# Altium schematic sheet RK3588_BOOTLOADER_MAYBE_SDIO.SchDoc
size 594 x 420 mm; SheetNumber: 7; SheetTotal: 23
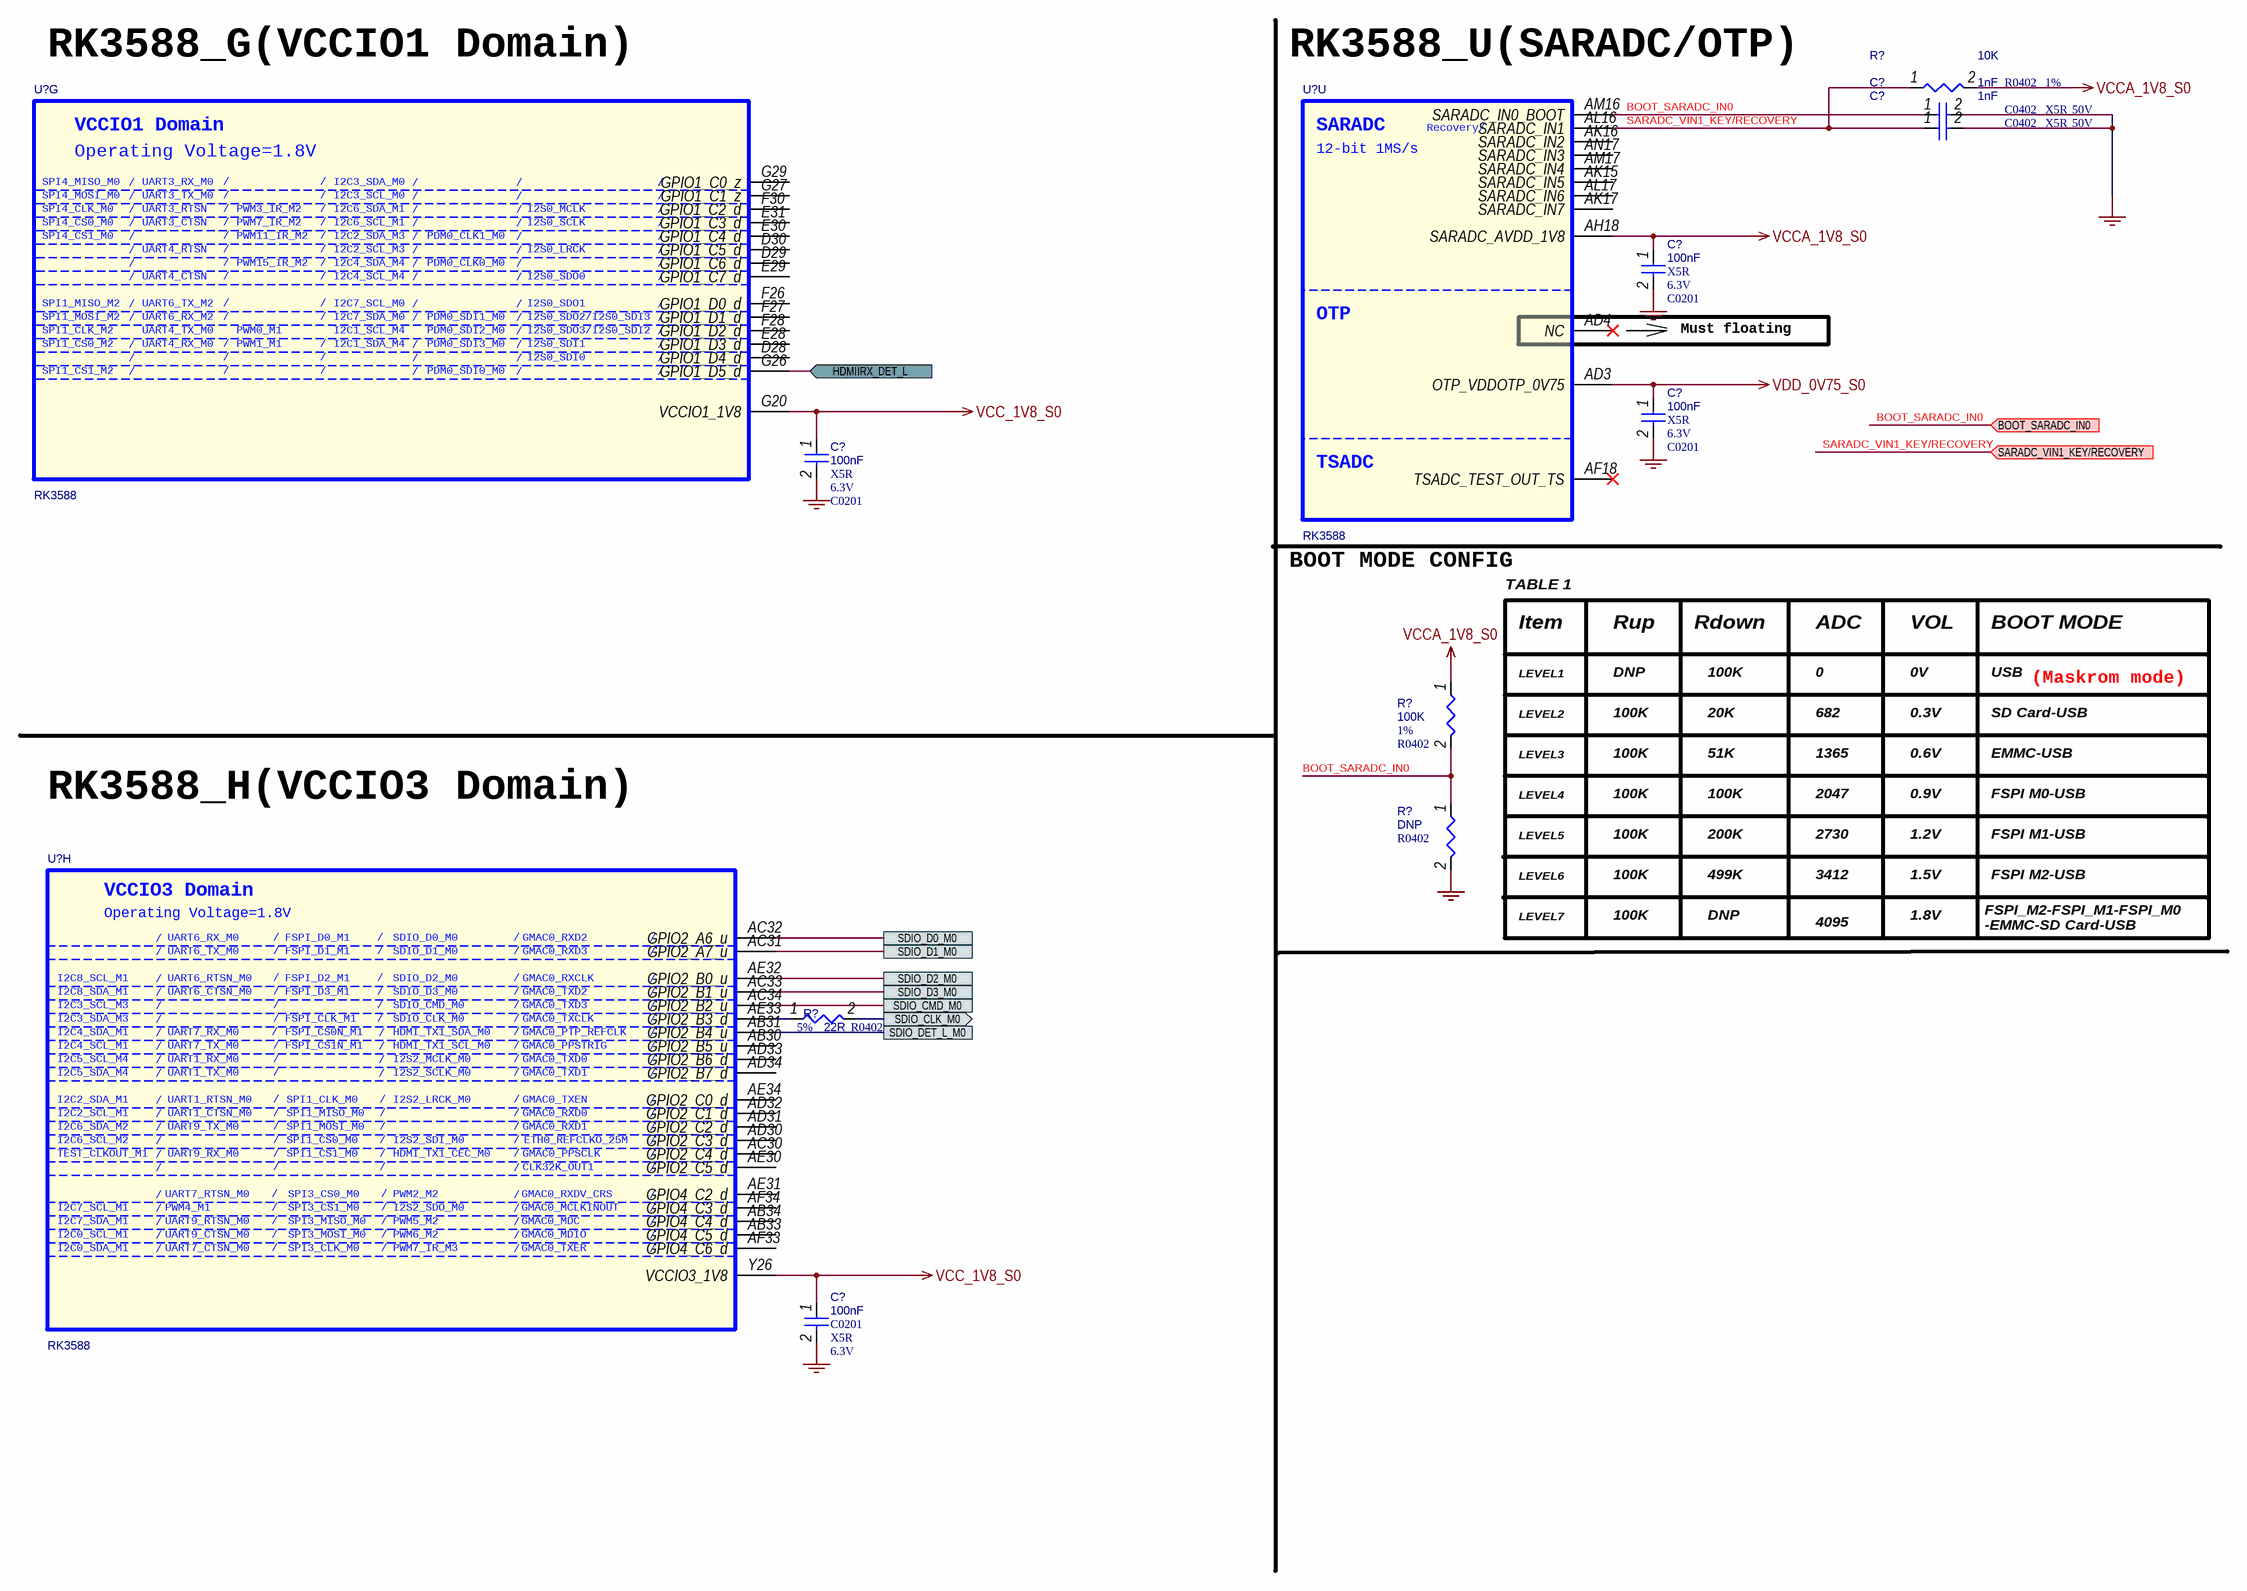
[diagram p0: RK3588_BOOTLOADER_MAYBE_SDIO.SchDoc]

## Parts
(Parts that share a designator on the sheet are numbered #1, #2 ... from top to bottom, then left to right.)
C?#1  1nF  Dielectric: X5R  Voltage: 50V  [C0402]
C?#2  1nF  Dielectric: X5R  Voltage: 50V  [C0402]
C?#3  100nF  Dielectric: X5R  Voltage: 6.3V  [C0201]
C?#4  100nF  Dielectric: X5R  Voltage: 6.3V  [C0201]
C?#5  100nF  Dielectric: X5R  Voltage: 6.3V  [C0201]
C?#6  100nF  Dielectric: X5R  Voltage: 6.3V  [C0201]
R?#1  10K  Tolerance: 1%  [R0402]
R?#2  100K  Tolerance: 1%  [R0402]
R?#3  DNP  [R0402]
R?#4  22R  Tolerance: 5%  [R0402]
U?#1  RK3588  [BGA1088_23R00X23R00X2R00]  (part G of 26)
U?#2  RK3588  [BGA1088_23R00X23R00X2R00]  (part U of 26)
U?#3  RK3588  [BGA1088_23R00X23R00X2R00]  (part H of 26)

## Ports
BOOT_SARADC_IN0 (in, see BUTTON[1C]), HDMIIRX_DET_L (in, see HDMI2_0_RX[4C]), SARADC_VIN1_KEY/RECOVERY (in, see BUTTON[1A]), SDIO_CLK_M0 (out, see SD_CARD_SDIO[2B]), SDIO_CMD_M0 (see SD_CARD_SDIO[2B]), SDIO_D0_M0 (see SD_CARD_SDIO[2B]), SDIO_D1_M0 (see SD_CARD_SDIO[2B]), SDIO_D2_M0 (see SD_CARD_SDIO[2B]), SDIO_D3_M0 (see SD_CARD_SDIO[2B]), SDIO_DET_L_M0 (see SD_CARD_SDIO[2B])

## Nets
GND: C?#1.2 C?#2.2 C?#3.2 C?#4.2 C?#5.2 C?#6.2 R?#3.2
VCC_1V8_S0: C?#5.1 C?#6.1 U?#1.G20(VCCIO1_1V8) U?#3.Y26(VCCIO3_1V8)
VCCA_1V8_S0: C?#3.1 R?#1.2 R?#2.1 U?#2.AH18(SARADC_AVDD_1V8)
VDD_0V75_S0: C?#4.1 U?#2.AD3(OTP_VDDOTP_0V75)
BOOT_SARADC_IN0: C?#1.1 R?#2.2 R?#3.1 U?#2.AM16(SARADC_IN0_BOOT) ; port BOOT_SARADC_IN0
HDMIIRX_DET_L: U?#1.G26(GPIO1_D5_d) ; port HDMIIRX_DET_L
SARADC_VIN1_KEY/RECOVERY: C?#2.1 R?#1.1 U?#2.AL16(SARADC_IN1) ; port SARADC_VIN1_KEY/RECOVERY
SDIO_CLK_M0: R?#4.2 ; port SDIO_CLK_M0
SDIO_CMD_M0: U?#3.AC34(GPIO2_B2_u) ; port SDIO_CMD_M0
SDIO_D0_M0: U?#3.AC32(GPIO2_A6_u) ; port SDIO_D0_M0
SDIO_D1_M0: U?#3.AC31(GPIO2_A7_u) ; port SDIO_D1_M0
SDIO_D2_M0: U?#3.AE32(GPIO2_B0_u) ; port SDIO_D2_M0
SDIO_D3_M0: U?#3.AC33(GPIO2_B1_u) ; port SDIO_D3_M0
SDIO_DET_L_M0: U?#3.AB31(GPIO2_B4_u) ; port SDIO_DET_L_M0
NetR?#4_1: R?#4.1 U?#3.AE33(GPIO2_B3_d)

Not connected (* = marked no-connect by the designer): U?#1 D28(GPIO1_D4_d) D29(GPIO1_C6_d) D30(GPIO1_C5_d) E28(GPIO1_D3_d) E29(GPIO1_C7_d) E30(GPIO1_C4_d) E31(GPIO1_C3_d) F26(GPIO1_D0_d) F27(GPIO1_D1_d) F28(GPIO1_D2_d) F30(GPIO1_C2_d) G27(GPIO1_C1_z) G29(GPIO1_C0_z); U?#2 AD4(NC)* AF18(TSADC_TEST_OUT_TS)* AK15(SARADC_IN5) AK16(SARADC_IN2) AK17(SARADC_IN7) AL17(SARADC_IN6) AM17(SARADC_IN4) AN17(SARADC_IN3); U?#3 AB30(GPIO2_B5_u) AB33(GPIO4_C5_d) AB34(GPIO4_C4_d) AC30(GPIO2_C4_d) AD30(GPIO2_C3_d) AD31(GPIO2_C2_d) AD32(GPIO2_C1_d) AD33(GPIO2_B6_d) AD34(GPIO2_B7_d) AE30(GPIO2_C5_d) AE31(GPIO4_C2_d) AE34(GPIO2_C0_d) AF33(GPIO4_C6_d) AF34(GPIO4_C3_d)

## Notes on the sheet
- RK3588_G(VCCIO1 Domain)
- (near U?#2) RK3588_U(SARADC/OTP)
- (near C?#3) Must floating
- BOOT MODE CONFIG
- TABLE 1
- LEVEL1
- Item
- Rup
- DNP
- Rdown
- 100K
- ADC
- 0
- VOL
- 0V
- BOOT MODE
- USB
- LEVEL2
- 20K
- 682
- 0.3V
- SD Card-USB
- (Maskrom mode)
- RK3588_H(VCCIO3 Domain)
- LEVEL3
- LEVEL4
- 51K
- 1365
- 2047
- 0.9V
- 0.6V
- EMMC-USB
- FSPI M0-USB
- LEVEL5
- 200K
- 2730
- 1.2V
- FSPI M1-USB
- LEVEL6
- LEVEL7
- 499K
- 3412
- 4095
- 1.8V
- 1.5V
- FSPI_M2-FSPI_M1-FSPI_M0
  -EMMC-SD Card-USB
- FSPI M2-USB
- 420x594
- Формат А2
- (in symbol SOC_RK3588, part G) VCCIO1 Domain; Operating Voltage=1.8V; SPI4_MISO_M0; /; UART3_RX_M0; I2C3_SDA_M0; SPI4_MOSI_M0; UART3_TX_M0; I2C3_SCL_M0; SPI4_CLK_M0; UART3_RTSN; PWM3_IR_M2; I2C6_SDA_M1; I2S0_MCLK; SPI4_CS0_M0; UART3_CTSN; PWM7_IR_M2; I2C6_SCL_M1; I2S0_SCLK; SPI4_CS1_M0; PWM11_IR_M2; I2C2_SDA_M3; PDM0_CLK1_M0; UART4_RTSN; I2C2_SCL_M3; I2S0_LRCK; PWM15_IR_M2; I2C4_SDA_M4; PDM0_CLK0_M0; UART4_CTSN; I2C4_SCL_M4; I2S0_SDO0; SPI1_MISO_M2; UART6_TX_M2; I2C7_SCL_M0; I2S0_SDO1; SPI1_MOSI_M2; UART6_RX_M2; I2C7_SDA_M0; PDM0_SDI1_M0; I2S0_SDO2/I2S0_SDI3; SPI1_CLK_M2; UART4_TX_M0; PWM0_M1; I2C1_SCL_M4; PDM0_SDI2_M0; I2S0_SDO3/I2S0_SDI2; SPI1_CS0_M2; UART4_RX_M0; PWM1_M1; I2C1_SDA_M4; PDM0_SDI3_M0; I2S0_SDI1; I2S0_SDI0; SPI1_CS1_M2; PDM0_SDI0_M0
- (in symbol SOC_RK3588, part H) VCCIO3 Domain; Operating Voltage=1.8V; /; UART6_RX_M0; FSPI_D0_M1; SDIO_D0_M0; GMAC0_RXD2; UART6_TX_M0; FSPI_D1_M1; SDIO_D1_M0; GMAC0_RXD3; I2C8_SCL_M1; UART6_RTSN_M0; FSPI_D2_M1; SDIO_D2_M0; GMAC0_RXCLK; I2C8_SDA_M1; UART6_CTSN_M0; FSPI_D3_M1; SDIO_D3_M0; GMAC0_TXD2; I2C3_SCL_M3; SDIO_CMD_M0; GMAC0_TXD3; I2C3_SDA_M3; FSPI_CLK_M1; SDIO_CLK_M0; GMAC0_TXCLK; I2C4_SDA_M1; UART7_RX_M0; FSPI_CS0N_M1; HDMI_TX1_SDA_M0; GMAC0_PTP_REFCLK; I2C4_SCL_M1; UART7_TX_M0; FSPI_CS1N_M1; HDMI_TX1_SCL_M0; GMAC0_PPSTRIG; I2C5_SCL_M4; UART1_RX_M0; I2S2_MCLK_M0; GMAC0_TXD0; I2C5_SDA_M4; UART1_TX_M0; I2S2_SCLK_M0; GMAC0_TXD1; I2C2_SDA_M1; UART1_RTSN_M0; SPI1_CLK_M0; I2S2_LRCK_M0; GMAC0_TXEN; I2C2_SCL_M1; UART1_CTSN_M0; SPI1_MISO_M0; GMAC0_RXD0; I2C6_SDA_M2; UART9_TX_M0; SPI1_MOSI_M0; GMAC0_RXD1; I2C6_SCL_M2; SPI1_CS0_M0; I2S2_SDI_M0; ETH0_REFCLKO_25M; TEST_CLKOUT_M1; UART9_RX_M0; SPI1_CS1_M0; HDMI_TX1_CEC_M0; GMAC0_PPSCLK; CLK32K_OUT1; UART7_RTSN_M0; SPI3_CS0_M0; PWM2_M2; GMAC0_RXDV_CRS; I2C7_SCL_M1; PWM4_M1; SPI3_CS1_M0; I2S2_SDO_M0; GMAC0_MCLKINOUT; I2C7_SDA_M1; UART9_RTSN_M0; SPI3_MISO_M0; PWM5_M2; GMAC0_MDC; I2C0_SCL_M1; UART9_CTSN_M0; SPI3_MOSI_M0; PWM6_M2; GMAC0_MDIO; I2C0_SDA_M1; UART7_CTSN_M0; SPI3_CLK_M0; PWM7_IR_M3; GMAC0_TXER
- (in symbol SOC_RK3588, part U) SARADC; Recovery/; 12-bit 1MS/s; OTP; TSADC

## Library data of the parts
C?#1 = CAP NP_Dup1: cap,1.00nF,+/-10%,50V,X5R,C0402; Part Reference: C1510; Manufacturer: TDK; RK PN: C1005X5R1H102K050BA; Priority: A; Tolerance: 10%; PCB Footprint: C0402; Value: 1nF; Part Type: C0402; Manufacturer PN: C1005X5R1H102K050BA; Created by: JJJ
C?#2 = CAP NP_Dup1: cap,1.00nF,+/-10%,50V,X5R,C0402; Part Reference: C1511; Manufacturer: TDK; RK PN: C1005X5R1H102K050BA; Priority: A; Tolerance: 10%; PCB Footprint: C0402; Value: 1nF; Part Type: C0402; Manufacturer PN: C1005X5R1H102K050BA; Created by: JJJ
C?#3 = CAP NP_Dup1: cap,100.00nF,+/-10%,6.3V,X5R,C0201; Part Reference: C1501; Manufacturer: TDK; RK PN: C0603X5R0J104K030BC; Priority: A; Tolerance: 10%; PCB Footprint: C0201; Value: 100nF; Part Type: C0201; Manufacturer PN: C0603X5R0J104K030BC; Created by: JJJ
C?#4 = CAP NP_Dup1: cap,100.00nF,+/-10%,6.3V,X5R,C0201; Part Reference: C1505; Manufacturer PN: C0603X5R0J104K030BC; Manufacturer: TDK; Tolerance: 10%; Priority: A; PCB Footprint: C0201; Value: 100nF; Created by: JJJ; Part Type: C0201; RK PN: C0603X5R0J104K030BC
C?#5 = CAP NP_Dup1: cap,100.00nF,+/-10%,6.3V,X5R,C0201; Part Reference: C1502; Manufacturer: TDK; RK PN: C0603X5R0J104K030BC; Priority: A; Tolerance: 10%; PCB Footprint: C0201; Value: 100nF; Part Type: C0201; Manufacturer PN: C0603X5R0J104K030BC; Created by: JJJ
C?#6 = CAP NP_Dup1: cap,100.00nF,+/-10%,6.3V,X5R,C0201; Part Reference: C1503; Manufacturer: TDK; RK PN: C0603X5R0J104K030BC; Priority: A; Tolerance: 10%; PCB Footprint: C0201; Value: 100nF; Part Type: C0201; Manufacturer PN: C0603X5R0J104K030BC; Created by: JJJ
R?#1 = RESISTOR_Dup2: НЁУГєсД¤µзЧи,10K,+/-1%,R0402,1/16W.; Part Reference: R1500; Manufacturer: YAGEO; RK PN: RC0402FR-0710KL; Priority: A; Wattage: 1/16W; PCB Footprint: R0402; Value: 10K; Part Type: НЁУГєсД¤µзЧи; Manufacturer PN: RC0402FR-0710KL; Created by: YTL
R?#2 = RESISTOR_Dup2: НЁУГєсД¤µзЧи,100K,+/-1%,R0402,1/16W.; Part Reference: R1511; Manufacturer: YAGEO; RK PN: RC0402FR-07100KL; Priority: A; Wattage: 1/16W; PCB Footprint: R0402; Value: 100K; Part Type: НЁУГєсД¤µзЧи; Manufacturer PN: RC0402FR-07100KL; Created by: YTL
R?#3 = RESISTOR_Dup2: Did Not Place.; Part Reference: R1509; RK PN: DNPR0402; Priority: A; PCB Footprint: R0402; Value: DNP; Part Type: DNP; Manufacturer PN: DNPR0402; Created by: JJJ
R?#4 = RESISTOR_Dup2: НЁУГєсД¤µзЧи,22R,+/-5%,R0402,1/16W.; Part Reference: R1320; Manufacturer PN: RC0402JR-0722RL; Manufacturer: YAGEO; Wattage: 1/16W; Priority: A; PCB Footprint: R0402; Value: 22R; Created by: YTL; Part Type: НЁУГєсД¤µзЧи; RK PN: RC0402JR-0722RL
U?#1-U?#3 = SOC_RK3588: ROCKCHIP SOC; Part Reference: U1000; Manufacturer: Rockchip (ИрРѕОў); SWAP_INFO: (S1+S2+S3+S4+S5+S6+S7+S8+S9+S10+S11+S12+S13+S14+S15+S16+S17+S18+S19+S20+S21+S22+S23+S24+S25+S26); SPLIT_INST: TRUE; Priority: A; Value: RK3588; PCB Footprint: BGA1088_23R00X23R00X2R00; Created by: YWQ; Manufacturer PN: RK3588; Part Type: SOC; RK PN: RK3588